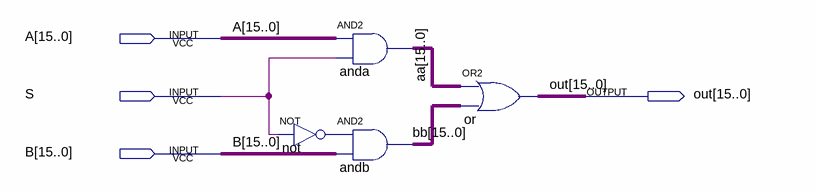
[diagram p0: schematic sheet]
// Quartus schematic plexor2.bdf as structural Verilog: 4 symbols, 4 pins
module plexor2 (
  input  [15:0] A,
  input  S,
  input  [15:0] B,
  output [15:0] out
);

  wire not_out;
  wire [15:0] aa, bb;

  not \not  (not_out, S);
  assign aa = A & {16{S}};  // AND2 anda, 16 bits wide
  assign bb = {16{not_out}} & B;  // AND2 andb, 16 bits wide
  assign out = aa | bb;  // OR2 or, 16 bits wide
endmodule
